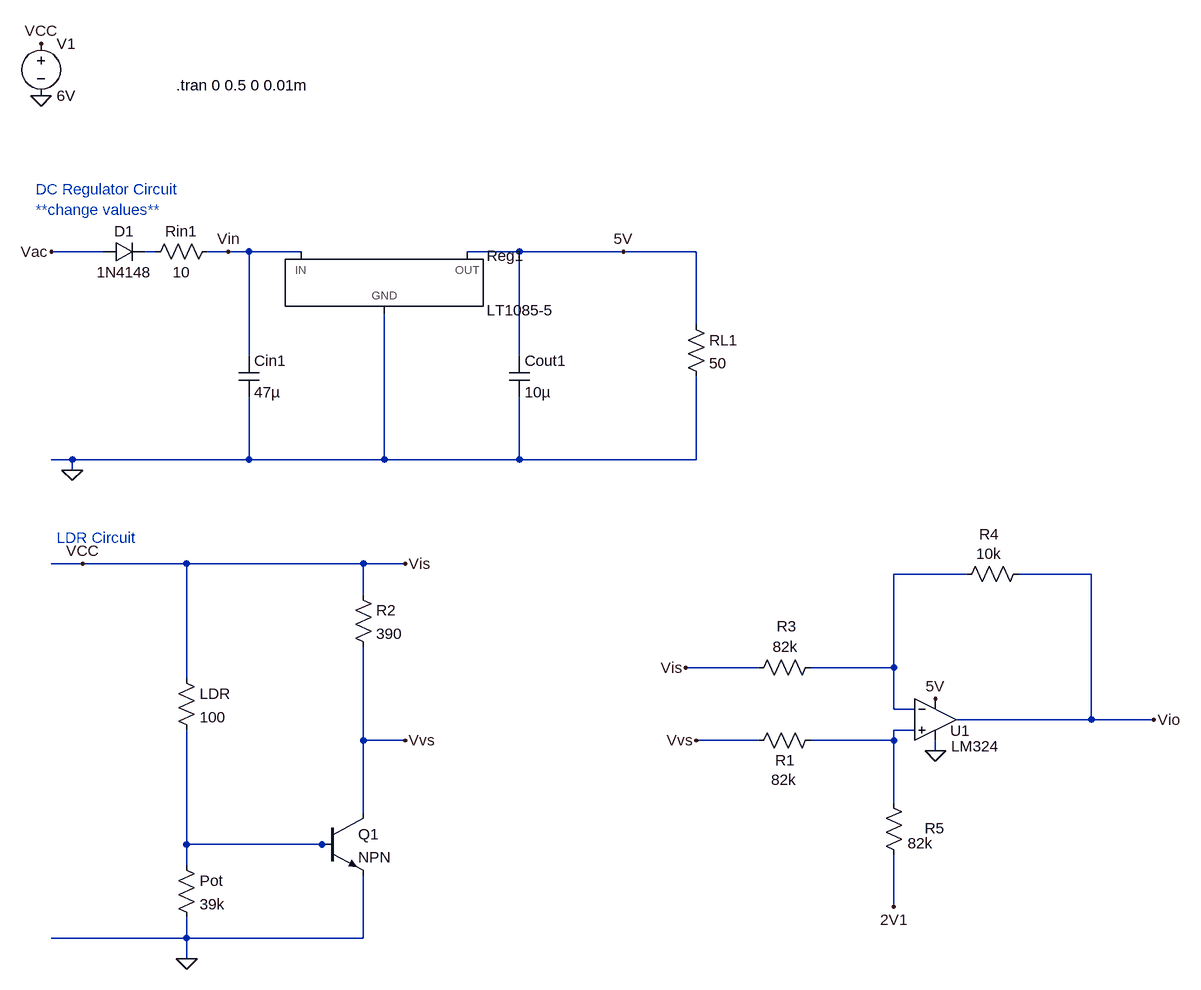
[diagram p0: schematic ECSE_DESIGN_LTSPICE.asc]
ECSE_DESIGN_LTSPICE.asc, the LTspice schematic file:
Version 4
SHEET 1 1696 1344
WIRE -80 224 -160 224
WIRE 0 224 -16 224
WIRE 112 224 80 224
WIRE 144 224 112 224
WIRE 224 224 144 224
WIRE 560 224 480 224
WIRE 720 224 560 224
WIRE 832 224 720 224
WIRE 832 336 832 224
WIRE 144 384 144 224
WIRE 560 384 560 224
WIRE -128 544 -160 544
WIRE 144 544 144 448
WIRE 144 544 -128 544
WIRE 352 544 352 320
WIRE 352 544 144 544
WIRE 560 544 560 448
WIRE 560 544 352 544
WIRE 832 544 832 416
WIRE 832 544 560 544
WIRE -128 560 -128 544
WIRE -112 704 -160 704
WIRE 48 704 -112 704
WIRE 320 704 48 704
WIRE 384 704 320 704
WIRE 1248 720 1136 720
WIRE 1440 720 1328 720
WIRE 320 752 320 704
WIRE 928 864 816 864
WIRE 1136 864 1136 720
WIRE 1136 864 1008 864
WIRE 48 880 48 704
WIRE 1136 928 1136 864
WIRE 1168 928 1136 928
WIRE 1440 944 1440 720
WIRE 1440 944 1232 944
WIRE 1536 944 1440 944
WIRE 1168 960 1136 960
WIRE 320 976 320 832
WIRE 384 976 320 976
WIRE 928 976 832 976
WIRE 1136 976 1136 960
WIRE 1136 976 1008 976
WIRE 1200 992 1200 976
WIRE 1136 1072 1136 976
WIRE 320 1088 320 976
WIRE 48 1136 48 960
WIRE 256 1136 48 1136
WIRE 272 1136 256 1136
WIRE 48 1168 48 1136
WIRE 1136 1232 1136 1152
WIRE 48 1280 48 1248
WIRE 48 1280 -160 1280
WIRE 320 1280 320 1184
WIRE 320 1280 48 1280
WIRE 48 1312 48 1280
FLAG -128 560 0
FLAG -160 224 Vac
FLAG 720 224 5V
FLAG 112 224 Vin
FLAG 48 1312 0
FLAG -176 -96 VCC
FLAG -176 -16 0
FLAG 384 704 Vis
FLAG 384 976 Vvs
FLAG -112 704 VCC
FLAG 1200 992 0
FLAG 1200 912 5V
FLAG 832 976 Vvs
FLAG 816 864 Vis
FLAG 1536 944 Vio
FLAG 1136 1232 2V1
SYMBOL PowerProducts/LT1085-5 352 224 R0
SYMATTR InstName Reg1
SYMBOL res 816 320 R0
SYMATTR InstName RL1
SYMATTR Value 50
SYMBOL res 96 208 R90
WINDOW 0 0 56 VBottom 2
WINDOW 3 32 56 VTop 2
SYMATTR InstName Rin1
SYMATTR Value 10
SYMBOL diode -80 240 R270
WINDOW 0 32 32 VTop 2
WINDOW 3 0 32 VBottom 2
SYMATTR InstName D1
SYMATTR Value 1N4148
SYMBOL cap 128 384 R0
SYMATTR InstName Cin1
SYMATTR Value 47µ
SYMATTR SpiceLine Rser=0.001
SYMBOL cap 544 384 R0
SYMATTR InstName Cout1
SYMATTR Value 10µ
SYMATTR SpiceLine Rser=0.001
SYMBOL res 32 1152 R0
SYMATTR InstName Pot
SYMATTR Value 39k
SYMBOL res 304 736 R0
SYMATTR InstName R2
SYMATTR Value 390
SYMBOL npn 256 1088 R0
SYMATTR InstName Q1
SYMBOL res 32 864 R0
SYMATTR InstName LDR
SYMATTR Value 100
SYMBOL voltage -176 -112 R0
SYMATTR InstName V1
SYMATTR Value 6V
SYMBOL Opamps/opamp2 1200 880 R0
WINDOW 0 23 81 Left 2
WINDOW 3 24 105 Left 2
SYMATTR InstName U1
SYMATTR Value LM324
SYMBOL res 1024 960 R90
WINDOW 0 62 55 VBottom 2
WINDOW 3 61 57 VTop 2
SYMATTR InstName R1
SYMATTR Value 82k
SYMBOL res 1024 848 R90
WINDOW 0 -32 53 VBottom 2
WINDOW 3 -32 55 VTop 2
SYMATTR InstName R3
SYMATTR Value 82k
SYMBOL res 1344 704 R90
WINDOW 0 -30 61 VBottom 2
WINDOW 3 -31 62 VTop 2
SYMATTR InstName R4
SYMATTR Value 10k
SYMBOL res 1152 1168 R180
WINDOW 0 -62 57 Left 2
WINDOW 3 -44 34 Left 2
SYMATTR InstName R5
SYMATTR Value 82k
TEXT -152 664 Left 2 ;LDR Circuit
TEXT -184 128 Left 2 ;DC Regulator Circuit\n**change values**
TEXT 32 -32 Left 2 !.tran 0 0.5 0 0.01m

The netlist it stands for:
* ECSE_DESIGN_LTSPICE.asc
XReg1 0 5V Vin LT1085-5  ; pins GND OUT IN
RL1 5V 0 50
Rin1 Vin N001 10
D1 Vac N001 1N4148
Cin1 Vin 0 47µ Rser=0.001
Cout1 5V 0 10µ Rser=0.001
R§Pot N004 0 39k
R2 Vis Vvs 390
Q1 Vvs N004 0 0 NPN
R§LDR Vis N004 100
V1 Vis 0 6V
XU1 N003 N002 5V 0 Vio LM324  ; pins In+ In- V+ V- OUT
R1 N003 Vvs 82k
R3 N002 Vis 82k
R4 Vio N002 10k
R5 2V1 N003 82k
.model D D
.lib standard.dio
.model NPN NPN
.model PNP PNP
.lib standard.bjt
* LDR Circuit
* DC Regulator Circuit
* **change values**
.tran 0 0.5 0 0.01m
.backanno
.end